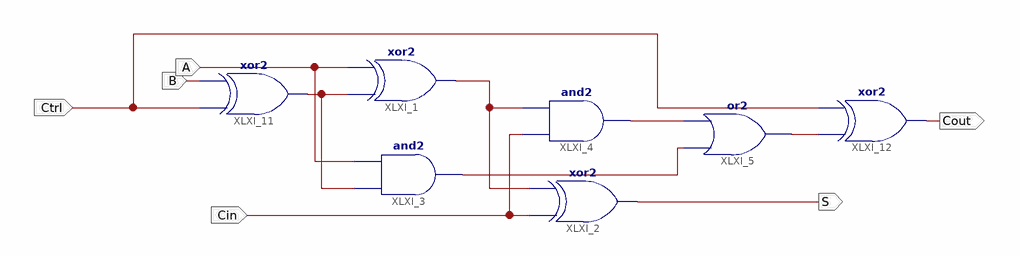
[diagram p0: schematic sheet 1]
// Xilinx ISE schematic Addsub1b.sch (kintex7) as structural Verilog: 7 symbols, 6 ports
module Addsub1b (
  input  Cin,
  input  A,
  input  Ctrl,
  input  B,
  output S,
  output Cout
);

  wire Xlnx, XLXN_1, XLXN_3, XLXN_4, XLXN_25;

  xor XLXI_1 (XLXN_1, XLXN_25, A);
  xor XLXI_2 (S, Cin, XLXN_1);
  or XLXI_5 (Xlnx, XLXN_3, XLXN_4);
  and XLXI_3 (XLXN_3, XLXN_25, A);
  and XLXI_4 (XLXN_4, Cin, XLXN_1);
  xor XLXI_11 (XLXN_25, Ctrl, B);
  xor XLXI_12 (Cout, Xlnx, Ctrl);
endmodule
